# EAGLE design schema_v1_1 (EAGLE 6.2)
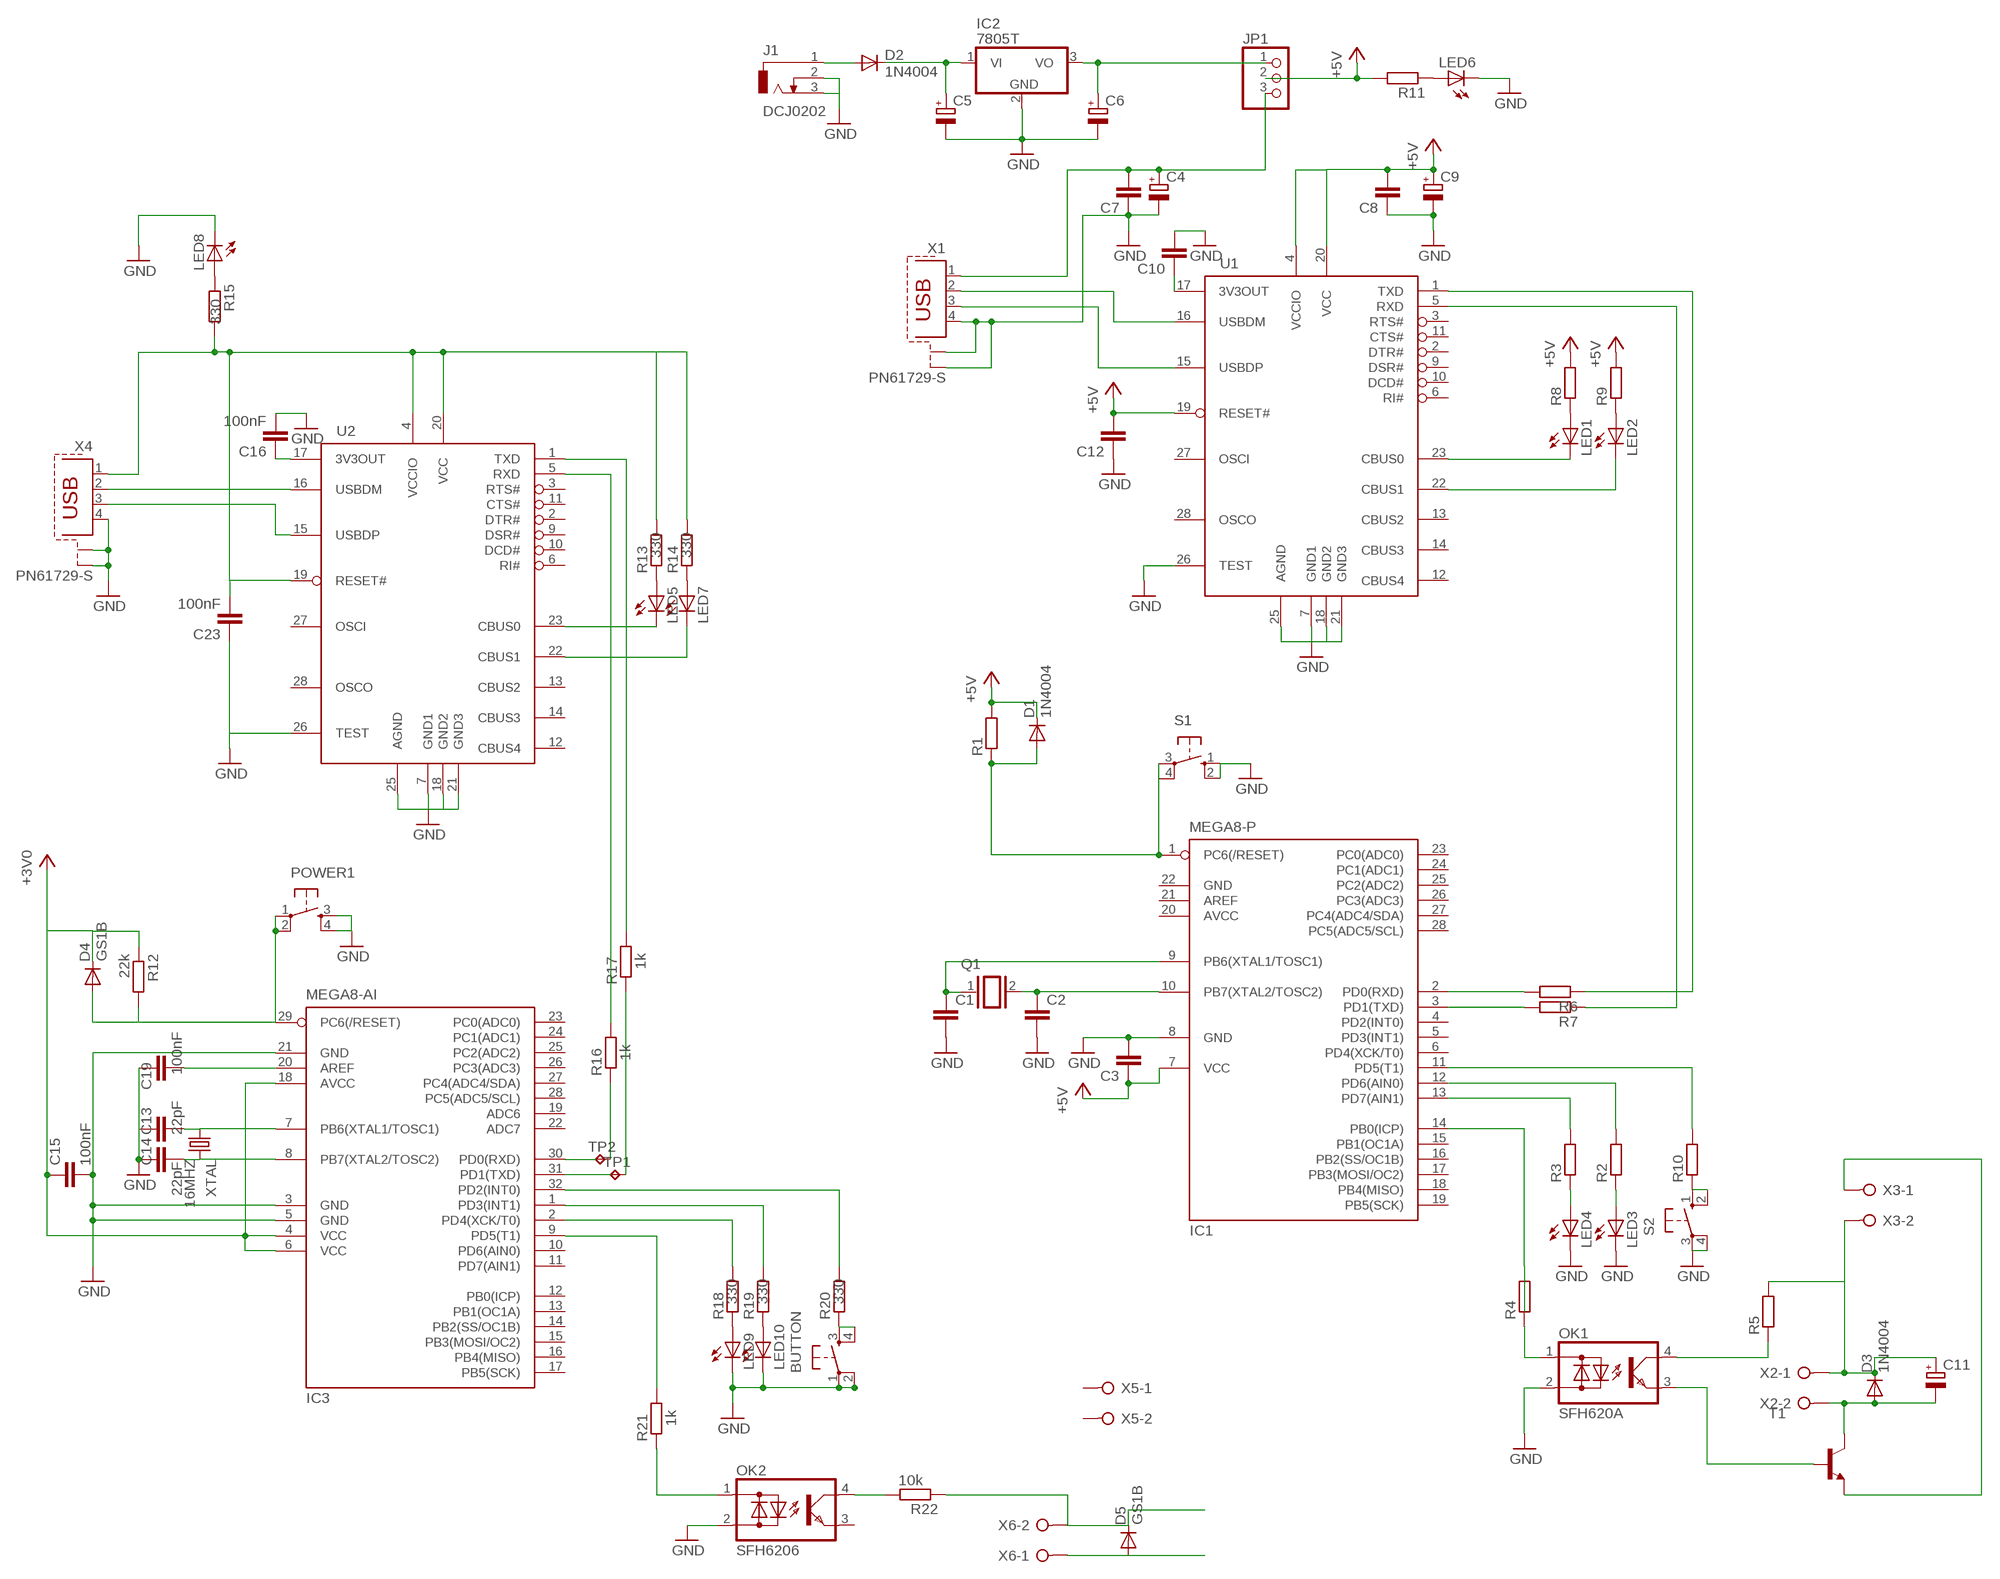
[diagram p0: schematic, sheet 1]

## Parts
BUTTON  TAC_SWITCHSMD  [TACTILE_SWITCH_SMD]
C1  C-EU025-025X050  [C025-025X050]
C2  C-EU025-025X050  [C025-025X050]
C3  C-EU025-025X050  [C025-025X050]
C4  CPOL-EUE2.5-5  [E2,5-5]
C5  CPOL-EUE2.5-5  [E2,5-5]
C6  CPOL-EUE2.5-5  [E2,5-5]
C7  C-EU025-025X050  [C025-025X050]
C8  C-EU025-025X050  [C025-025X050]
C9  CPOL-EUE2.5-5  [E2,5-5]
C10  C-EU025-025X050  [C025-025X050]
C11  CPOL-EUE2.5-5  [E2,5-5]
C12  C-EU025-025X050  [C025-025X050]
C13  22pF  C-EUC0805  [C0805]
C14  22pF  C-EUC0805  [C0805]
C15  100nF  C-EUC0805  [C0805]
C16  100nF  C-EUC0805  [C0805]
C19  100nF  C-EUC0805  [C0805]
C23  100nF  C-EUC0805  [C0805]
D1  1N4004  [DO41-10]
D2  1N4004  [DO41-10]
D3  1N4004  [DO41-10]
D4  GS1B  DIODE-DO214AC  [DO214AC]
D5  GS1B  DIODE-DO214AC  [DO214AC]
IC1  MEGA8-P  [DIL28-3]
IC2  7805T  [TO220H]
IC3  MEGA8-AI  [TQFP32-08]
J1  DCJ0202  [DCJ0202]
JP1  PINHD-1X3/90  [1X03/90]
LED1  LED3MM  [LED3MM]
LED2  LED3MM  [LED3MM]
LED3  LED3MM  [LED3MM]
LED4  LED3MM  [LED3MM]
LED5  LEDSMT1206  [1206]
LED6  LED3MM  [LED3MM]
LED7  LEDSMT1206  [1206]
LED8  LEDSMT1206  [1206]
LED9  LEDSMT1206  [1206]
LED10  LEDSMT1206  [1206]
OK1  SFH620A  [DIL04]
OK2  SFH6206  [DIL4-SMD]
POWER1  TAC_SWITCHSMD  [TACTILE_SWITCH_SMD]
Q1  XTAL  [Q]
R1  R-EU_0207/10  [0207/10]
R2  R-EU_0207/10  [0207/10]
R3  R-EU_0207/10  [0207/10]
R4  R-EU_0207/10  [0207/10]
R5  R-EU_0207/10  [0207/10]
R6  R-EU_0207/10  [0207/10]
R7  R-EU_0207/10  [0207/10]
R8  R-EU_0207/10  [0207/10]
R9  R-EU_0207/10  [0207/10]
R10  R-EU_0207/10  [0207/10]
R11  R-EU_0207/10  [0207/10]
R12  22k  R-EU_R0805  [R0805]
R13  330  R-EU_R0805  [R0805]
R14  330  R-EU_R0805  [R0805]
R15  330  R-EU_R0805  [R0805]
R16  1k  R-EU_R0805  [R0805]
R17  1k  R-EU_R0805  [R0805]
R18  330  R-EU_R0805  [R0805]
R19  330  R-EU_R0805  [R0805]
R20  330  R-EU_R0805  [R0805]
R21  1k  R-EU_R0805  [R0805]
R22  10k  R-EU_R0805  [R0805]
S1  10-XX  [B3F-10XX]
S2  10-XX  [B3F-10XX]
T1  -NPN-TO92  [TO92]
TP1  TPTP13R  [TP13R]
TP2  TPTP13R  [TP13R]
U1  FT232RL  [SSOP28DB]
U2  FT232RL  [SSOP28DB]
X1  PN61729-S  [PN61729-S]
X2  W237-02P  [W237-132]
X3  W237-02P  [W237-132]
X4  PN61729-S  [PN61729-S]
X5  W237-02P  [W237-132]
X6  W237-02P  [W237-132]
XTAL  16MHZ  CSM-7X-DU  [CSM-7X-DU]

## Nets
+3V0: C15.1 D4.C IC3.4(VCC) IC3.6(VCC) IC3.18(AVCC) R12.1
+5V: C3.1 C8.2 C9.+ C12.2 D1.C IC1.7(VCC) JP1.2 R1.2 R8.2 R9.2 R11.2 U1.4(VCCIO) U1.19(RESET#) U1.20(VCC)
GND: BUTTON.1 BUTTON.2 C1.2 C2.2 C3.2 C4.- C5.- C6.- C7.1 C8.1 C9.- C10.2 C12.1 C13.1 C14.1 C15.2 C16.2 C19.2 C23.1 IC1.8(GND) IC2.2(GND) IC3.3(GND) IC3.5(GND) IC3.21(GND) J1.2 J1.3 LED3.K(C) LED4.K(C) LED6.K(C) LED8.C LED9.C LED10.C OK1.2(AC2) OK2.2(AC2) POWER1.3 POWER1.4 S1.1(S) S1.2(S1) S2.3(P) S2.4(P1) U1.7(GND1) U1.18(GND2) U1.21(GND3) U1.25(AGND) U1.26(TEST) U2.26(TEST) X1.4 X1.S1 X1.S2 X4.4 X4.S1 X4.S2
N$1: C2.1 IC1.10(PB7(XTAL2/TOSC2)) Q1.2
N$2: C1.1 IC1.9(PB6(XTAL1/TOSC1)) Q1.1
N$3: D1.A IC1.1(PC6(/RESET)) R1.1 S1.3(P) S1.4(P1)
N$4: IC1.13(PD7(AIN1)) R3.2
N$5: IC1.14(PB0(ICP)) R4.2
N$6: LED3.A R2.1
N$7: LED4.A R3.1
N$8: R10.1 S2.1(S) S2.2(S1)
N$9: IC1.11(PD5(T1)) R10.2
N$10: IC1.12(PD6(AIN0)) R2.2
N$11: OK1.4(C) R5.1
N$12: OK1.1(AC1) R4.1
N$13: D2.A J1.1
N$14: C5.+ D2.C IC2.1(VI)
N$15: C6.+ IC2.3(VO) JP1.1
N$16: C4.+ C7.2 JP1.3 X1.1
N$17: LED6.A R11.1
N$18: U1.16(USBDM) X1.2
N$19: U1.15(USBDP) X1.3
N$20: C10.1 U1.17(3V3OUT)
N$21: LED1.A R8.1
N$22: LED2.A R9.1
N$23: LED1.K(C) U1.23(CBUS0)
N$24: LED2.K(C) U1.22(CBUS1)
N$25: R6.1 U1.1(TXD)
N$26: IC1.2(PD0(RXD)) R6.2
N$27: IC1.3(PD1(TXD)) R7.2
N$28: R7.1 U1.5(RXD)
N$29: C11.+ D3.C R5.2 X2.1 X3.2
N$30: C11.- D3.A T1.3(C) X2.2
N$31: OK1.3(E) T1.2(B)
N$32: T1.1(E) X3.1
N$33: IC3.30(PD0(RXD))
N$34: R16.1 TP2.TP
N$35: C14.2 IC3.8(PB7(XTAL2/TOSC2)) XTAL.2
N$36: C13.2 IC3.7(PB6(XTAL1/TOSC1)) XTAL.1
N$37: C19.1 IC3.20(AREF)
N$38: D4.A IC3.29(PC6(/RESET)) POWER1.1 POWER1.2 R12.2
N$39: LED5.A R13.1
N$40: LED7.A R14.1
N$41: LED5.C U2.23(CBUS0)
N$42: LED7.C U2.22(CBUS1)
N$43: R16.2 U2.5(RXD)
N$44: R17.2 U2.1(TXD)
N$45: BUTTON.3 BUTTON.4 R20.1
N$46: IC3.2(PD4(XCK/T0)) R18.2
N$47: C23.2 R13.2 R14.2 R15.2 U2.4(VCCIO) U2.19(RESET#) U2.20(VCC) X4.1
N$48: U2.16(USBDM) X4.2
N$49: U2.15(USBDP) X4.3
N$50: IC3.1(PD3(INT1)) R19.2
N$51: LED8.A R15.1
N$52: IC3.32(PD2(INT0)) R20.2
N$96: C16.1 U2.17(3V3OUT)
N$97: LED9.A R18.1
N$98: LED10.A R19.1
N$99: IC3.31(PD1(TXD))
N$100: R17.1 TP1.TP
N$102: OK2.1(AC1) R21.1
N$103: IC3.9(PD5(T1)) R21.2
N$104: OK2.4(C) R22.2
N$105: D5.C R22.1 X6.2
N$106: D5.A X6.1
Unconnected: IC1.4(PD2(INT0)) IC1.5(PD3(INT1)) IC1.6(PD4(XCK/T0)) IC1.15(PB1(OC1A)) IC1.16(PB2(SS/OC1B)) IC1.17(PB3(MOSI/OC2)) IC1.18(PB4(MISO)) IC1.19(PB5(SCK)) IC1.21(AREF) IC1.23(PC0(ADC0)) IC1.24(PC1(ADC1)) IC1.25(PC2(ADC2)) IC1.26(PC3(ADC3)) IC1.27(PC4(ADC4/SDA)) IC1.28(PC5(ADC5/SCL)) IC3.10(PD6(AIN0)) IC3.11(PD7(AIN1)) IC3.12(PB0(ICP)) IC3.13(PB1(OC1A)) IC3.14(PB2(SS/OC1B)) IC3.15(PB3(MOSI/OC2)) IC3.16(PB4(MISO)) IC3.17(PB5(SCK)) IC3.19(ADC6) IC3.22(ADC7) IC3.23(PC0(ADC0)) IC3.24(PC1(ADC1)) IC3.25(PC2(ADC2)) IC3.26(PC3(ADC3)) IC3.27(PC4(ADC4/SDA)) IC3.28(PC5(ADC5/SCL)) OK2.3(E) U1.2(DTR#) U1.3(RTS#) U1.6(RI#) U1.9(DSR#) U1.10(DCD#) U1.11(CTS#) U1.12(CBUS4) U1.13(CBUS2) U1.14(CBUS3) U1.27(OSCI) U1.28(OSCO) U2.2(DTR#) U2.3(RTS#) U2.6(RI#) U2.9(DSR#) U2.10(DCD#) U2.11(CTS#) U2.12(CBUS4) U2.13(CBUS2) U2.14(CBUS3) U2.27(OSCI) U2.28(OSCO) X5.1 X5.2

## Power pins joined to a net without a drawn wire
AGND: U2.25(AGND)
AVCC: IC1.20(AVCC)
GND: IC1.22(GND)
GND1: U2.7(GND1)
GND2: U2.18(GND2)
GND3: U2.21(GND3)

## Library data of the parts
BUTTON POWER1 = SparkFun:TAC_SWITCH: Momentary Switch Button commonly used for reset or general input. Spark Fun Electronics SKU : COM-00097
C1-C3 C7 C8 C10 C12-C16 C19 C23 = rcl:C-EU: CAPACITOR, European symbol
C4-C6 C9 C11 = rcl:CPOL-EU: POLARIZED CAPACITOR, European symbol
D1-D3 = diode:1N4004: DIODE general purpose rectifier, 1 A
D4 D5 = diode:DIODE-: DIODE
IC1 = atmel:MEGA8-P: MICROCONTROLLER 8 Kbytes FLASH, 1 kbytes SRAM, 512 bytes EEPROM, USART, 4-channel 10 bit ADC, 2-channel 8 bit ADC Pin compatible with Atmega48, ATMega88, ATMega168 Source: avr.lbr; OC_FARNELL: unknown; OC_NEWARK: unknown
IC2 = linear:78*: Positive VOLTAGE REGULATOR Source: http://cache.national.com/ds/LM/LM78L05.pdf http://www.fairchildsemi.com/ds/LM/LM7805.pdf
IC3 = atmel:MEGA8: MICROCONTROLLER 8 Kbytes FLASH, 1 kbytes SRAM, 512 bytes EEPROM, USART, 6-channel 10 bit ADC, 2-channel 8 bit ADC Pin compatible with Atmega48, ATMega88, ATMega168 Source: avr.lbr; MPN: ATMEGA8-16AU; OC_FARNELL: 9171371; OC_NEWARK: 73M8863
J1 = con-jack:DCJ0202: DC POWER JACK Source: DCJ0202.pdf; OC_FARNELL: unknown; OC_NEWARK: unknown
JP1 = pinhead:PINHD-1X3: PIN HEADER
LED1-LED10 = led:LED: LED OSRAM: - CHIPLED LG R971, LG N971, LY N971, LG Q971, LY Q971, LO R971, LY R971 LH N974, LH R974 LS Q976, LO Q976, LY Q976 LO Q996 - Hyper CHIPLED LW Q18S LB Q993, LB Q99A, LB R99A - SideLED LS A670, LO A670, LY A670, LG A670, LP A670 LB A673, LV A673, LT A673, LW A673 LH A674 LY A675 LS A676, LA A676, LO A676, LY A676, LW A676 LS A679, LY A679, LG A679 - Hyper Micro SIDELED® LS Y876, LA Y876, LO Y876, LY Y876 LT Y87S - SmartLED LW L88C, LW L88S LB L89C, LB L89S, LG L890 LS L89K, LO L89K, LY L89K LS L896, LA L896, LO L896, LY L896 - TOPLED LS T670, LO T670, LY T670, LG T670, LP T670 LSG T670, LSP T670, LSY T670, LOP T670, LYG T670 LG T671, LOG T671, LSG T671 LB T673, LV T673, LT T673, LW T673 LH T674 LS T676, LA T676, LO T676, LY T676, LB T676, LH T676, LSB T676, LW T676 LB T67C, LV T67C, LT T67C, LS T67K, LO T67K, LY T67K, LW E67C LS E67B, LA E67B, LO E67B, LY E67B, LB E67C, LV E67C, LT E67C LW T67C LS T679, LY T679, LG T679 LS T770, LO T770, LY T770, LG T770, LP T770 LB T773, LV T773, LT T773, LW T773 LH T774 LS E675, LA E675, LY E675, LS T675 LS T776, LA T776, LO T776, LY T776, LB T776 LHGB T686 LT T68C, LB T68C - Hyper Mini TOPLED® LB M676 - Mini TOPLED Santana® LG M470 LS M47K, LO M47K, LY M47K Source: http://www.osram.convergy.de LUXEON: - LUMILED® LXK2-PW12-R00, LXK2-PW12-S00, LXK2-PW14-U00, LXK2-PW14-V00 LXK2-PM12-R00, LXK2-PM12-S00, LXK2-PM14-U00 LXK2-PE12-Q00, LXK2-PE12-R00, LXK2-PE12-S00, LXK2-PE14-T00, LXK2-PE14-U00 LXK2-PB12-K00, LXK2-PB12-L00, LXK2-PB12-M00, LXK2-PB14-N00, LXK2-PB14-P00, LXK2-PB14-Q00 LXK2-PR12-L00, LXK2-PR12-M00, LXK2-PR14-Q00, LXK2-PR14-R00 LXK2-PD12-Q00, LXK2-PD12-R00, LXK2-PD12-S00 LXK2-PH12-R00, LXK2-PH12-S00 LXK2-PL12-P00, LXK2-PL12-Q00, LXK2-PL12-R00 Source: www.luxeon.com KINGBRIGHT: KA-3528ASYC Source: www.kingbright.com
OK1 = optocoupler:SFH620: Optocoupler, Phototransistor Output, AC Input Source: http://www.vishay.com/docs/83675/sfh620.pdf; MPN: SFH620A-2; OC_FARNELL: 1469594; OC_NEWARK: 97K9546
OK2 = optocoupler:SFH620: Optocoupler, Phototransistor Output, AC Input Source: http://www.vishay.com/docs/83675/sfh620.pdf; MF: VISHAY/TELEFUNKEN; MPN: SFH6206-3; OC_FARNELL: 1469585; OC_NEWARK: 58K2214
Q1 = special:XTAL: CRYSTAL
R1-R22 = rcl:R-EU_: RESISTOR, European symbol
S1 S2 = switch-omron:10-XX: OMRON SWITCH; MPN: B3F-1000; OC_FARNELL: 176432; OC_NEWARK: 36M3542
T1 = transistor:*-NPN-: NPN Transistror BF959 corrected 2008.03.06
TP1 TP2 = testpad:TP: Test pad
U1 U2 = ftdichip-5:FT232RL: USB UART 4th Generation USB UART (USB <-> Serial) Controller
X1 X4 = con-berg:PN61729-S: BERG USB connector; OC_FARNELL: unknown; OC_NEWARK: unknown
X2 X3 X5 X6 = con-wago-508:W237-02P: WAGO SREW CLAMP; OC_FARNELL: unknown; OC_NEWARK: unknown
XTAL = crystal:CSM-7X-DU: SMD CRYSTAL Source: www.ecsxtal.com .. Crystal 3.6864MHz CSM_7X_DU.PDF; OC_FARNELL: unknown; OC_NEWARK: unknown

## Net classes
0 default: width 0.203 mm

## Board
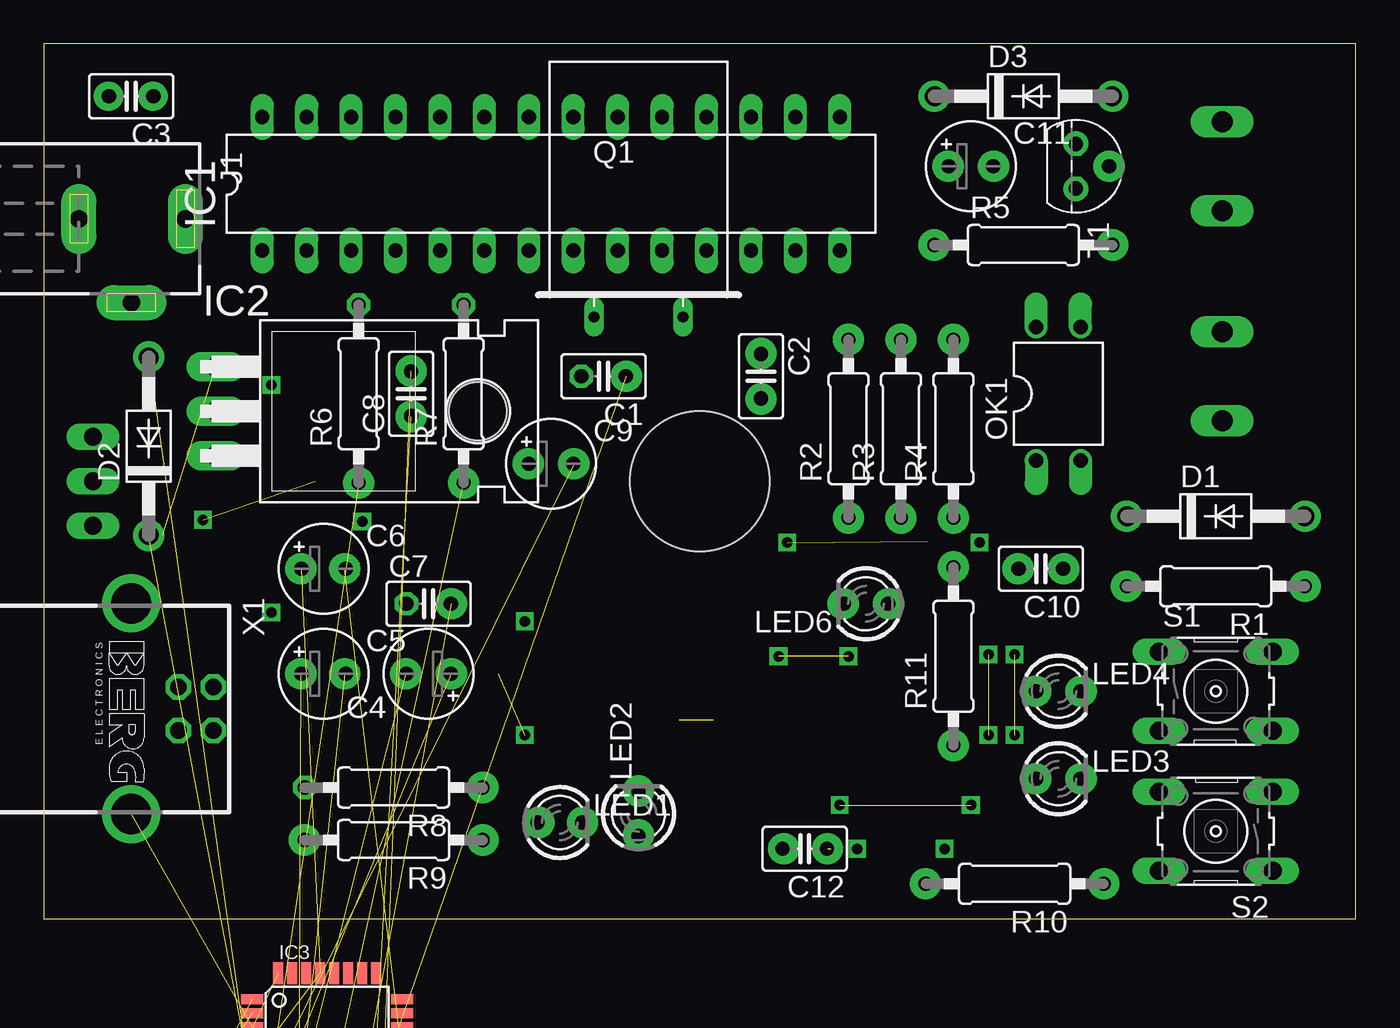
[diagram p1: board, top side]
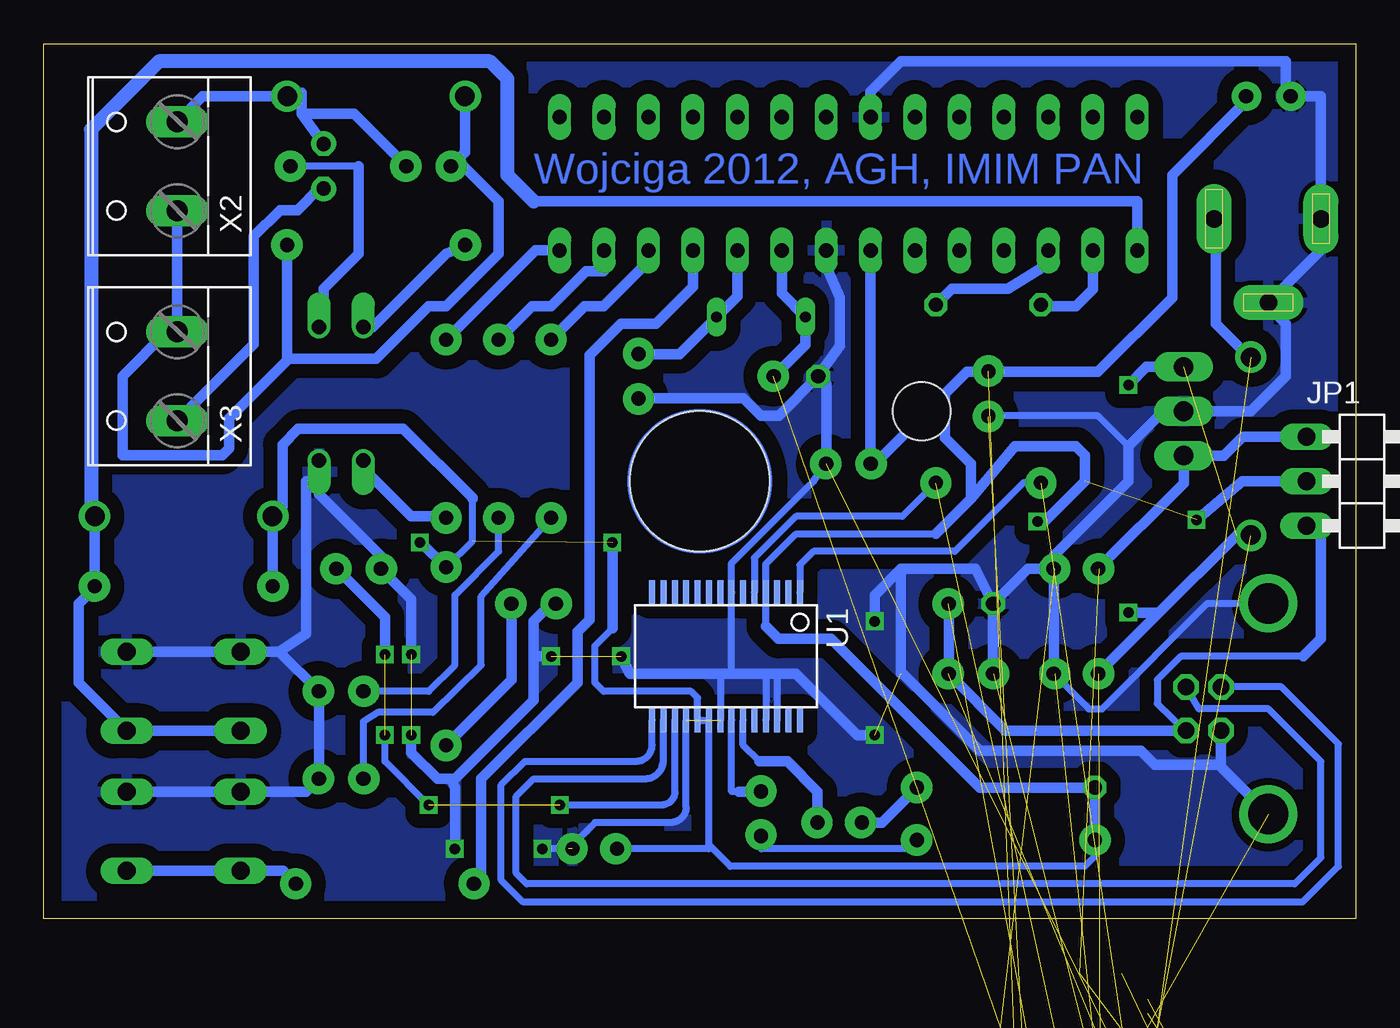
[diagram p2: board, bottom side, seen from below]

Size 75 x 50 mm. Coordinates in mm from the lower left corner, seen from the top.
Outline: 0,0 75,0 75,50 0,50 0,0
Copper layers (1*16): Top 0.035mm / dielectric 1.5mm / Bottom 0.035mm
Design rules: minimum track width 10mil, minimum drill 24mil, track to track 8mil, track to pad 8mil, pad to pad 8mil, via to via 8mil, smd to smd 8mil, copper to edge 40mil, drill to drill 8mil, minimum pad ring 10mil, minimum via ring 8mil, stop-mask expansion 4mil, vias tented up to drill 0mil, thermal gap 10mil
Holes 8 mm at 37.5,25

### Footprints (pad centres in the part's own frame; a part is rotated, then mirrored left to right if it is on the bottom)
TACTILE_SWITCH_SMD = smd 1.524 x 0.762: 1 -2.54,1.905; 2 2.54,1.905; 3 -2.54,-1.905; 4 2.54,-1.905
C025-025X050 = drill 0.813 octagon: 1 -1.27,0; 2 1.27,0
E2,5-5 = drill 0.813 pad 1.6: + -1.27,0 | drill 0.813 pad 1.6 octagon: - 1.27,0
C0805 = smd 1.3 x 1.5: 1 -0.95,0; 2 0.95,0
DO41-10 = drill 1.118: A 5.08,0; C -5.08,0
DO214AC = smd 1.8 x 1.7: A 2.05,0; C -2.05,0
DIL28-3 = drill 0.813 long: 1 -16.51,-3.81; 2 -13.97,-3.81; 3 -11.43,-3.81; 4 -8.89,-3.81; 5 -6.35,-3.81; 6 -3.81,-3.81; 7 -1.27,-3.81; 8 1.27,-3.81; 9 3.81,-3.81; 10 6.35,-3.81; 11 8.89,-3.81; 12 11.43,-3.81; 13 13.97,-3.81; 14 16.51,-3.81; 15 16.51,3.81; 16 13.97,3.81; 17 11.43,3.81; 18 8.89,3.81; 19 6.35,3.81; 20 3.81,3.81; 21 1.27,3.81; 22 -1.27,3.81; 23 -3.81,3.81; 24 -6.35,3.81; 25 -8.89,3.81; 26 -11.43,3.81; 27 -13.97,3.81; 28 -16.51,3.81
TO220H = drill 1.118 long: 1 -2.54,-10.16; 2 0,-10.16; 3 2.54,-10.16 | hole 3.302: 0,4.826
TQFP32-08 = smd 1.27 x 0.559: 1 -4.293,2.8; 2 -4.293,2; 3 -4.293,1.2; 4 -4.293,0.4; 5 -4.293,-0.4; 6 -4.293,-1.2; 7 -4.293,-2; 8 -4.293,-2.8; 17 4.293,-2.8; 18 4.293,-2; 19 4.293,-1.2; 20 4.293,-0.4; 21 4.293,0.4; 22 4.293,1.2; 23 4.293,2; 24 4.293,2.8 | smd 0.559 x 1.27: 9 -2.8,-4.293; 10 -2,-4.293; 11 -1.2,-4.293; 12 -0.4,-4.293; 13 0.4,-4.293; 14 1.2,-4.293; 15 2,-4.293; 16 2.8,-4.293; 25 2.8,4.293; 26 2,4.293; 27 1.2,4.293; 28 0.4,4.293; 29 -0.4,4.293; 30 -1.2,4.293; 31 -2,4.293; 32 -2.8,4.293
DCJ0202 = drill 1 pad 2 long: 1 0,3.1; 2 4.8,0; 3 0,-3
1X03/90 = drill 1.016 long: 1 -2.54,-3.81; 2 0,-3.81; 3 2.54,-3.81
LED3MM = drill 0.813 octagon: A -1.27,0; K 1.27,0
1206 = smd 1.6 x 1.803: A -1.422,0; C 1.422,0
DIL04 = drill 0.813 offset: 1 -1.27,-3.81; 2 1.27,-3.81; 3 1.27,3.81; 4 -1.27,3.81
DIL4-SMD = smd 1.6 x 2: 1 -1.27,-4.77; 2 1.27,-4.77; 3 1.27,4.77; 4 -1.27,4.77
Q = drill 0.61 long: 1 -2.54,-7.62; 2 2.54,-7.62
0207/10 = drill 0.813 octagon: 1 -5.08,0; 2 5.08,0
R0805 = smd 1.3 x 1.5: 1 -0.95,0; 2 0.95,0
B3F-10XX = drill 1.016 long: 1 -3.251,2.261; 2 3.251,2.261; 3 -3.251,-2.261; 4 3.251,-2.261
TO92 = drill 0.813 octagon: 1 1.27,0; 2 0,1.905; 3 -1.27,0
TP13R = smd 1.3 x 1.3: TP 0,0
SSOP28DB = smd 0.348 x 1.397: 1 -4.225,-3.656; 2 -3.575,-3.656; 3 -2.925,-3.656; 4 -2.275,-3.656; 5 -1.625,-3.656; 6 -0.975,-3.656; 7 -0.325,-3.656; 8 0.325,-3.656; 9 0.975,-3.656; 10 1.625,-3.656; 11 2.275,-3.656; 12 2.925,-3.656; 13 3.575,-3.656; 14 4.225,-3.656; 15 4.225,3.656; 16 3.575,3.656; 17 2.925,3.656; 18 2.275,3.656; 19 1.625,3.656; 20 0.975,3.656; 21 0.325,3.656; 22 -0.325,3.656; 23 -0.975,3.656; 24 -1.625,3.656; 25 -2.275,3.656; 26 -2.925,3.656; 27 -3.575,3.656; 28 -4.225,3.656
PN61729-S = drill 0.95 octagon: 1 1.25,4.71; 2 -1.25,4.71; 3 -1.25,2.71; 4 1.25,2.71 | drill 2.3 pad 2.9: S1 -6.02,0; S2 6.02,0
W237-132 = drill 1.194 long: 1 -2.54,-0.635; 2 2.54,-0.635
CSM-7X-DU = smd 5.5 x 2: 1 -4.75,0; 2 4.75,0

### Placement (x,y rotation side)
BUTTON  -20.8,-70.1 0 top  (outside the outline)
C1  32,31 180 top
C2  41,31 270 top
C3  5,47 180 top
C4  22,14 180 top
C5  16,14 0 top
C6  16,20 0 top
C7  22,18 0 top
C8  21,30 90 top
C9  29,26 0 top
C10  57,20 180 top
C11  53,43 0 top
C12  43.5,4 180 top
C13  19.1,-28.3 0 top  (outside the outline)
C14  -6.3,-34.4 0 top  (outside the outline)
C15  -0.1,-28.3 0 top  (outside the outline)
C16  -22.2,-50.2 0 top  (outside the outline)
C19  6.3,-28.3 0 top  (outside the outline)
C23  12.7,-28.3 0 top  (outside the outline)
D1  67,23 0 top
D2  6,27 90 top
D3  56,47 0 top
D4  -5.2,-28.3 0 top  (outside the outline)
D5  -50.4,-94.1 0 top  (outside the outline)
IC1  29,42 0 top
IC2  20,29 270 top
IC3  16.2,-7.4 0 top  (outside the outline)
J1  5,40 270 top
JP1  -1,25 270 bottom
LED1  29.5,5.5 0 top
LED2  34,6 90 top
LED3  58,8 0 top
LED4  58,13 0 top
LED5  6.1,-40.5 0 top  (outside the outline)
LED6  47,18 180 top
LED7  12.2,-40.5 0 top  (outside the outline)
LED8  18.3,-40.5 0 top  (outside the outline)
LED9  -21.9,-66.4 0 top  (outside the outline)
LED10  -21.9,-62.4 0 top  (outside the outline)
OK1  58,30 0 top
OK2  -28.6,-72.9 0 top  (outside the outline)
POWER1  0.3,-40.1 0 top  (outside the outline)
Q1  34,42 0 top
R1  67,19 180 top
R2  46,28 90 top
R3  49,28 90 top
R4  52,28 90 top
R5  56,38.5 0 top
R6  18,30 90 top
R7  24,30 90 top
R8  20,7.5 180 top
R9  20,4.5 180 top
R10  55.5,2 180 top
R11  52,15 90 top
R12  -1,-34.4 0 top  (outside the outline)
R13  4.2,-34.4 0 top  (outside the outline)
R14  9.4,-34.4 0 top  (outside the outline)
R15  14.6,-34.4 0 top  (outside the outline)
R16  19.8,-34.4 0 top  (outside the outline)
R17  -6.3,-40.5 0 top  (outside the outline)
R18  -22.2,-56.3 0 top  (outside the outline)
R19  -17,-56.3 0 top  (outside the outline)
R20  -22.2,-75.8 0 top  (outside the outline)
R21  -30.8,-81.9 0 top  (outside the outline)
R22  -30.8,-88 0 top  (outside the outline)
S1  67,13 0 top
S2  67,5 180 top
T1  59,43 270 top
TP1  23.2,-39.9 0 top  (outside the outline)
TP2  -7.2,-46 0 top  (outside the outline)
U1  36,15 180 bottom
U2  14.9,-20.7 0 top  (outside the outline)
X1  5,12 270 top
X2  68,43 90 bottom
X3  68,31 90 bottom
X4  -16.5,-36.8 0 top  (outside the outline)
X5  -38,-83.5 0 top  (outside the outline)
X6  -48.4,-83.5 0 top  (outside the outline)
XTAL  -0.2,-20.5 0 top  (outside the outline)

### Tracks (layer width: path | path; a pad name or v marks a point on that pad's centre or on a via)
+3V0  (5 unrouted)
+5V  (via drill 0.5 pad 1.78, 0.6)  (2 unrouted)
  Bottom 0.305: U1.20 37,11.32 | 53.42,21.5 v53.5,21.5
  Bottom 0.406: 24,22 32,22 33.73,20.27 U1.4 33.73,16.73 | R11.2 50.5,21.58 50.5,24 | R9.2 14.92,3.58 15.5,3 35.75,3 36.98,4.22 | U1.19 37.62,12.62 38,13 43,13 43.5,13.5 43.5,15.6 42.5,16.6 | 17.8,22.7 v18.2,22.7 | U1.19 37.62,11.32 | 37,11.32 37.6,11.32 U1.19 | 36.98,4.22 U1.20 | 36.98,4.22 36.98,4 C12.2
  Bottom 0.61: R1.2 D1.C 61.35,23.57 61.35,27.1 60.45,28 54.45,28 50.5,24.05 50.5,24 | R9.2 R8.2 21.5,7.5 30,16 33,16 33.73,16.73 | C3.1 6.27,46.73 10.5,42.5 10.5,35.5 14.73,31.27 C8.2 22.23,31.27 23.5,30 | 28,39 28,38.46 IC1.7 C9.+ v27.7,26 27.5,26 23.5,30 | 24,22 22,24 | 22,24 22,26 23.5,27.5 23.5,30 | JP1.2 6.5,25 v9.1,22.8 | 22,24 19.5,27 16,27 15.5,26.5 15.5,25 17.8,22.7 | R11.2 53.42,21.5 | 42.5,16.6 v42.5,21.5
GND  (via drill 0.5 pad 1.68, 0.5 pad 1.78, 0.6)  (26 unrouted)
  Bottom 0.305: 5,35 J1.2 | U1.25 33.73,12.72 | 33,14 33.08,13.93 | 34,14 33.73,13.72 | 35.5,14 35.67,14.18
  Bottom 0.406: C9.- 31,25 35.67,20.32 U1.7 35.67,14.18 | C5.- 15.27,12 14.5,12 8.48,18.02 X1.S1 | 36.33,14 U1.21 | X1.4 7.71,9 | 55.73,20.73 C10.2 | 60,25 59.27,25 | 46,18 LED6.K | 33.08,13.93 U1.26 | 33.73,13.72 U1.25 | C8.1 14.73,28.73 13,27 | 45,4 43.5,5.5 39.16,5.5 arc-90 38.27,6.38 U1.18 | C12.1 v44.8,4 v46.5,4
  Bottom 0.61: C6.- 17.27,20.73 13,25 13,27 11,29 IC2.2 6,29 4,31 4,34 5,35 | S1.2 S1.1 61.53,15.26 | 61.53,15.26 LED4.K LED3.K 60.01,7.26 S2.4 S2.3 | IC1.8 30.27,37.27 29.5,35.5 29.5,32.73 C1.2 | C9.- 30.27,30.54 C1.2 | C6.- C5.- | IC1.22 27.73,47.27 26,49 4,49 4,47.27 C3.2 v3.7,47 2,47 J1.3 2,38.2 J1.2 | C7.1 C4.- | X1.S2 7.71,8.69 | 7.71,8.69 X1.4 | 26,20 26,14 25.9,14 21.5,9.6 12.3,9.6 11.5,8.8 7.82,8.8 7.71,8.69 | 26,20 21.73,20 C7.1 | C6.- 18.73,20 C7.1 | OK1.2 59.27,25 59.27,24.27 55.73,20.73 | 61.53,15.26 60,16.29 60,25 | C10.2 54,18.27 v54,15.1 | v54,10.5 54,9.5 52.5,8 51.7,8 | 47,15 47,17 46,18 | v42,15 41.5,14 36.33,14 35.5,14 34,14 33,14 32,14 28.5,10.5 v27.5,10.5 | 47,15 v46,15 | v51.5,4 51.5,7.5 51.7,8 | 26,20 27.5,18.5 v27.5,17 | 47,15 47,12.5 51.5,8 51.7,8 | C2.2 35.02,29.73 35,29.75 34,28.75 32.98,28.75 C1.2
  pour Bottom (isolate 0.813): 0.5,49.5 74.5,49.5 74.5,0.5 0.5,0.5
N$1
  Bottom 0.61: IC1.10 35.35,35.57 Q1.2 38.65,32.27 C2.1
N$2
  Bottom 0.61: IC1.9 32.81,35.73 Q1.1 31.46,32.81 C1.1
N$3
  Bottom 0.61: D1.A R1.1 72.08,18.92 73,18 73,13.49 S1.4 S1.3 | IC1.1 12.49,41 47,41
  Bottom 0.813: 47,41 48.5,42.5 48.5,48 49.5,49 68.4,49 72.3,45.1 72.3,23.22 D1.A
N$4
  Bottom 0.61: IC1.13 42.97,37.03 43,37 44,37 46,35 47.08,35 R3.2
N$5
  Bottom 0.61: IC1.14 46.89,38.19 R4.2
N$6
  Bottom 0.406: R2.1 50,18.42 50,14.5 52.75,11.8 55.9,11.8 56.73,11.27 LED3.A
N$7  (via drill 0.5 pad 1.78)
  Bottom 0.406: R3.1 v49,22.9 49,21 51.5,18.5 51.5,14.5 53,13 v56.7,13 LED4.A
N$8
  Bottom 0.61: S2.1 S2.2 61.32,2.74 R10.1
N$9
  Bottom 0.61: IC1.11 37.89,36.11 40,34 42,34 43.8,32.2 43.8,17.1 44.5,16.4 44.5,13.5 50,8 50,2.42 R10.2
N$10
  Bottom 0.61: R2.2 44.08,35 43,35 40.43,37.57 IC1.12
N$11
  Bottom 0.61: OK1.4 56.19,33.81 52,38 R5.1
N$12
  Bottom 0.61: OK1.1 56.73,25.73 54,23 52.08,23 R4.1
N$13
  Bottom 0.61: D2.A 6.08,32.08 8,34 8,39.9 J1.1
N$14  (via drill 0.6)  (1 unrouted)
  Bottom 0.61: D2.C 6.81,21.92 11.37,17.36 | C5.+ 11.37,17.36 | IC2.1 11.96,31.54 v13,30.5 | v13,17.5 11.5,17.5 11.37,17.36
N$15
  Bottom 0.61: IC2.3 8.54,26.46 | IC2.3 9.84,24.89 C6.+ | JP1.1 6.46,27.54 7.54,26.46 IC2.3
N$16
  Bottom 0.305: 2,22.46 JP1.3 | 9.75,10.75 X1.1
  Bottom 0.406: 3,15 10,15 11.35,13.65 11.35,12.3 9.75,10.75
  Bottom 0.61: C7.2 C4.+ 20.02,10.75 X1.1 | 2,22.46 2,16 3,15
N$17
  Bottom 0.61: R11.1 48.27,13.65 LED6.A
N$18
  Bottom 0.406: X1.2 8.96,12 5,12 2,9 2,3.5 3.5,2 47.4,2 48,2.6 48,7 47,8 40.63,8 arc-90 39.58,9.05 U1.16
N$19  (via drill 0.5 pad 1.42)
  Bottom 0.406: X1.3 v7.7,13.25 4.25,13.25 1,10 1,3 3.05,0.95 47.6,0.95 48.85,2.2 48.85,7.65 47.5,9 41.15,9 arc-90 40.23,9.92 U1.15
N$20  (via drill 0.6)  (2 unrouted)
  Bottom 0.406: v55.5,10.5 55.5,9 v53,6.5 | v45.5,6.5 39.69,6.5 arc-90 38.92,7.26 U1.17
  Bottom 0.61: C10.1 55.5,17.23 v55.5,15.1
N$21
  Bottom 0.61: R8.1 27.08,5.5 LED1.A
N$22
  Bottom 0.305: R9.1 25.58,4
  Bottom 0.406: LED2.A 34,4 25.58,4
N$23
  Bottom 0.305: U1.23 35,11.32
  Bottom 0.406: U1.23 35.02,9.93 34.1,9
  Bottom 0.61: LED1.K 30.77,7.27 32.5,9 34.1,9
N$24
  Bottom 0.406: 35.27,7.27 35.67,7.27 U1.22
  Bottom 0.61: LED2.K 35.27,7.27
N$25
  Bottom 0.406: U1.1 31.77,20.23 31,21 22.92,21 19,24.92 R6.1
N$26
  Bottom 0.61: IC1.2 15.03,35.97 16,35 17.92,35 R6.2
N$27
  Bottom 0.61: IC1.3 17.57,37.43 19.9,36 23.08,36 R7.2
N$28
  Bottom 0.406: U1.5 34.38,20.62 32,23 25.92,23 R7.1
N$29
  Bottom 0.61: 51.37,43.37 C11.+ | 51.37,43.37 50.92,43.81 D3.C 50.92,47.08 | R5.2 61.08,32.08 61,32 | 61,32 56,32 53,35 52,35 49,38 49,41 51.37,43.37 | X2.1 X3.2 67.96,33.54 70.5,31 70.5,26.5 64.8,26.5 64.4,26.9 64.4,28.6 61,32
N$30  (via drill 0.5 pad 1.78)
  Bottom 0.61: 60.27,46 T1.3 | 60.27,46 60.27,47.19 D3.A v61.1,47 65.91,47 X2.2 | C11.- 57.27,46 60.27,46
N$31  (via drill 0.5 pad 1.78)
  Bottom 0.406: 57,43 v60.9,43 T1.2
  Bottom 0.61: 57,43 57,38 59,36 59,34.08 OK1.3
N$32
  Bottom 0.61: X3.1 63,32.83 63,39 61.5,40.5 60.5,40.5 59.27,41.73 T1.1
N$34  (1 unrouted)
N$35  (via drill 0.5 pad 1.78)  (3 unrouted)
  other vias: 6,32.1
N$36  (via drill 0.5 pad 1.78)  (3 unrouted)
  other vias: 6,21.9
N$37  (via drill 0.5 pad 1.78)  (2 unrouted)
  other vias: 17.2,20
N$38  (via drill 0.5 pad 1.78)  (5 unrouted)
  other vias: 14.7,20
N$39  (via drill 0.5 pad 1.78)  (2 unrouted)
  other vias: 23.3,14
N$40  (via drill 0.5 pad 1.78)  (2 unrouted)
  other vias: 20.7,14
N$41  (via drill 0.5 pad 1.78)  (2 unrouted)
  other vias: 17.2,14
N$42  (via drill 0.5 pad 1.78)  (2 unrouted)
  other vias: 14.7,14
N$43  (via drill 0.5 pad 1.78)  (2 unrouted)
  other vias: 24,24.9
N$44  (via drill 0.5 pad 1.78)  (2 unrouted)
  other vias: 18,24.9
N$45  (via drill 0.5 pad 1.78)  (3 unrouted)
  other vias: 30.3,26
N$46  (1 unrouted)
N$47  (via drill 0.5 pad 1.78)  (8 unrouted)
  other vias: 33.3,31
N$48  (via drill 0.5 pad 1.78)  (2 unrouted)
  other vias: 21,28.7
N$49  (via drill 0.5 pad 1.78)  (2 unrouted)
  other vias: 21,31.3
N$50  (1 unrouted)
N$51  (via drill 0.5 pad 1.78)  (2 unrouted)
  other vias: 23.3,18
N$52  (1 unrouted)
N$53  (via drill 0.5 pad 1.78)
  other vias: 14.9,4.5
N$54  (via drill 0.5 pad 1.78)
  other vias: 25.1,4.5
N$55  (via drill 0.5 pad 1.78)
  other vias: 25.1,7.5
N$56  (via drill 0.5 pad 1.78)
  other vias: 28.3,5.5
N$57  (via drill 0.5 pad 1.78)
  other vias: 30.8,5.5
N$58  (via drill 0.5 pad 1.78)
  other vias: 34,4.8
N$59  (via drill 0.5 pad 1.78)
  other vias: 34,7.3
N$60  (via drill 0.5 pad 1.78)
  other vias: 42.3,4
N$61  (via drill 0.5 pad 1.78)
  other vias: 50.4,2
N$62  (via drill 0.5 pad 1.78)
  other vias: 60.6,2
N$63  (via drill 0.5 pad 1.78)
  other vias: 56.7,8
N$64  (via drill 0.5 pad 1.78)
  other vias: 59.3,8
N$65  (via drill 0.5 pad 1.78)
  other vias: 59.3,13
N$66  (via drill 0.5 pad 1.78)
  other vias: 45.7,18
N$67  (via drill 0.5 pad 1.78)
  other vias: 48.3,18
N$68  (via drill 0.5 pad 1.78)
  other vias: 52,9.9
N$69  (via drill 0.5 pad 1.78)
  other vias: 52,20.1
N$70  (via drill 0.5 pad 1.78)
  other vias: 52,22.9
N$71  (via drill 0.5 pad 1.78)
  other vias: 46,22.9
N$72  (via drill 0.5 pad 1.78)
  other vias: 55.7,20
N$73  (via drill 0.5 pad 1.78)
  other vias: 58.3,20
N$74  (via drill 0.5 pad 1.78)
  other vias: 61.9,19
N$75  (via drill 0.5 pad 1.78)
  other vias: 61.9,23
N$76  (via drill 0.5 pad 1.78)
  other vias: 72.1,23
N$77  (via drill 0.5 pad 1.78)
  other vias: 72.1,19
N$78  (via drill 0.5 pad 1.78)
  other vias: 41,29.7
N$79  (via drill 0.5 pad 1.78)
  other vias: 41,32.3
N$80  (via drill 0.5 pad 1.78)
  other vias: 46,33.1
N$81  (via drill 0.5 pad 1.78)
  other vias: 49,33.1
N$82  (via drill 0.5 pad 1.78)
  other vias: 52,33.1
N$83  (via drill 0.5 pad 1.78)
  other vias: 50.9,38.5
N$84  (via drill 0.5 pad 1.78)
  other vias: 61.1,38.5
N$85  (via drill 0.5 pad 1.78)
  other vias: 51.7,43
N$86  (via drill 0.5 pad 1.78)
  other vias: 54.3,43
N$87  (via drill 0.5 pad 1.78)
  other vias: 50.9,47
N$88  (via drill 0.5 pad 1.42)
  other vias: 9.7,13.25
N$89  (via drill 0.5 pad 1.42)
  other vias: 7.7,10.75
N$90  (via drill 0.5 pad 1.42)
  other vias: 9.7,10.75
N$91  (via drill 0.5 pad 1.68)
  other vias: 6.25,47
N$92  (via drill 0.5 pad 1.42)
  other vias: 59,41.7
N$93  (via drill 0.5 pad 1.42)
  other vias: 59,44.3
N$94  (via drill 0.5 pad 2.54)
  other vias: 5,18.05
N$95  (via drill 0.5 pad 2.54)
  other vias: 5,5.95
N$96  (1 unrouted)
N$97  (1 unrouted)
N$98  (1 unrouted)
N$100  (1 unrouted)
N$102  (1 unrouted)
N$103  (1 unrouted)
N$104  (1 unrouted)
N$105  (2 unrouted)
N$106  (1 unrouted)
(copper drawn outside any net)
  shapes: Bottom circle x2

### Text on the board
Bottom: Wojciga 2012, AGH, IMIM PAN